# EAGLE schematic RPi-HA (EAGLE 6.5.0)
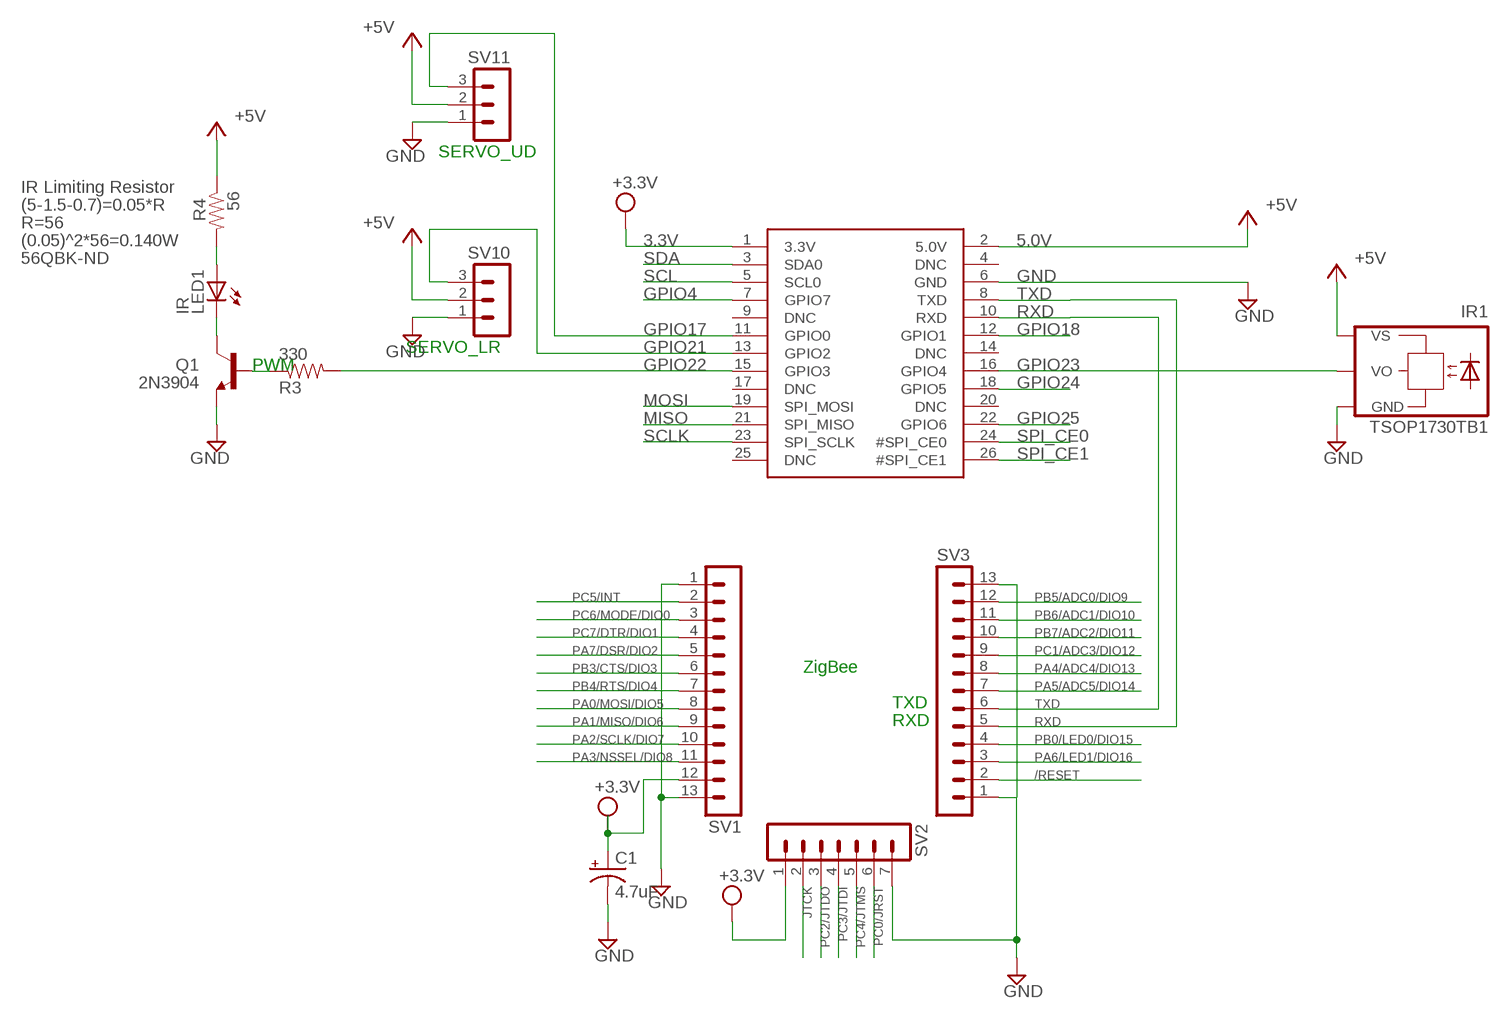
[diagram p0: schematic, sheet 1]

## Parts
C1  4.7uF  CPOL-USSANYO_SMD_A5  [SANYO-OSCON_SMD_A5]
IR1  TSOP1730TB1  [TSOP17_TB1]
LED1  IR  LED5MM  [LED5MM]
Q1  2N3904  TRANSISTOR_NPNTO92  [TO-92]
R3  330  RESISTORAXIAL-0.3  [AXIAL-0.3]
R4  56  RESISTORAXIAL-0.3  [AXIAL-0.3]
SV1  MA13-1  [MA13-1]
SV2  MA07-1  [MA07-1]
SV3  MA13-1  [MA13-1]
SV10  MA03-1  [MA03-1]
SV11  MA03-1  [MA03-1]
U$2  RASPBERRYPI_BB  [RASBERRYPI_SHIELD]

## Nets
3.3V: U$2.1(3.3V) ; supply symbol labelled +3.3V
5.0V: U$2.2(5.0V) ; supply symbol labelled +5V
+5V: IR1.VS R4.P$1 SV10.2 SV11.2
/RESET: SV3.2
D3: R3.P$2
GND: C1.- IR1.GND Q1.1(E) SV1.1 SV1.13 SV2.7 SV3.1 SV3.13 SV10.1 SV11.1 U$2.6(GND)
GPIO4: U$2.7(GPIO7)
GPIO17: SV11.3 U$2.11(GPIO0)
GPIO18: U$2.12(GPIO1)
GPIO21: SV10.3 U$2.13(GPIO2)
GPIO22: U$2.15(GPIO3)
GPIO23: IR1.VO U$2.16(GPIO4)
GPIO24: U$2.18(GPIO5)
GPIO25: U$2.22(GPIO6)
JTCK: SV2.2
MISO: U$2.21(SPI_MISO)
MOSI: U$2.19(SPI_MOSI)
N$5: Q1.2(B) R3.P$1
N$6: LED1.A R4.P$2
N$7: LED1.K(C) Q1.3(C)
PA0/MOSI/DIO5: SV1.8
PA1/MISO/DIO6: SV1.9
PA2/SCLK/DIO7: SV1.10
PA3/NSSEL/DIO8: SV1.11
PA4/ADC4/DIO13: SV3.8
PA5/ADC5/DIO14: SV3.7
PA6/LED1/DIO16: SV3.3
PA7/DSR/DIO2: SV1.5
PB0/LED0/DIO15: SV3.4
PB3/CTS/DIO3: SV1.6
PB4/RTS/DIO4: SV1.7
PB5/ADC0/DIO9: SV3.12
PB6/ADC1/DIO10: SV3.11
PB7/ADC2/DIO11: SV3.10
PC0/JRST: SV2.6
PC1/ADC3/DIO12: SV3.9
PC2/JTDO: SV2.3
PC3/JTDI: SV2.4
PC4/JTMS: SV2.5
PC5/INT: SV1.2
PC6/MODE/DIO0: SV1.3
PC7/DTR/DIO1: SV1.4
RXD: SV3.5 U$2.10(RXD)
SCL: U$2.5(SCL0)
SCLK: U$2.23(SPI_SCLK)
SDA: U$2.3(SDA0)
SPI_CE0: U$2.24(#SPI_CE0)
SPI_CE1: U$2.26(#SPI_CE1)
TXD: SV3.6 U$2.8(TXD)
VCC: C1.+ SV1.12 SV2.1 ; supply symbol labelled +3.3V
Unconnected: U$2.4(DNC) U$2.9(DNC) U$2.14(DNC) U$2.17(DNC) U$2.20(DNC) U$2.25(DNC)

## Notes on the sheet
- SERVO_UD
- IR Limiting Resistor
- (5-1.5-0.7)=0.05*R
- R=56
- (0.05)^2*56=0.140W
- 56QBK-ND
- SERVO_LR
- PWM
- ZigBee
- TXD
- RXD

## Library data of the parts
C1 = rcl:CPOL-US: POLARIZED CAPACITOR, American symbol
IR1 = telefunken:TSOP17*TB1: TSOP17..TB1 IR Receiver Modules for Remote Control Systems Source: http://www.vishay.com/docs/82042/82042.pdf; OC_FARNELL: unknown; OC_NEWARK: unknown
LED1 = SparkFun:LED: LEDs Standard schematic elements and footprints for 5mm, 3mm, 1206, and 0603 sized LEDs. 5mm - Spark Fun Electronics SKU : COM-00529 (and others)
Q1 = SparkFun:TRANSISTOR_NPN: Transistor NPN BJT configuration in SOT23 package. MMBT2222 is the common NPN we use. Double check BCE configuration again layout.
R3 R4 = SparkFun:RESISTOR: Resistor Basic schematic elements and footprints for 0603, 1206, and PTH resistors.
SV1 SV3 = con-lstb:MA13-1: PIN HEADER; OC_FARNELL: unknown; OC_NEWARK: unknown
SV2 = con-lstb:MA07-1: PIN HEADER; OC_FARNELL: unknown; OC_NEWARK: unknown
SV10 SV11 = con-lstb:MA03-1: PIN HEADER; OC_FARNELL: unknown; OC_NEWARK: unknown
U$2 = microbuilder:RASPBERRYPI_B